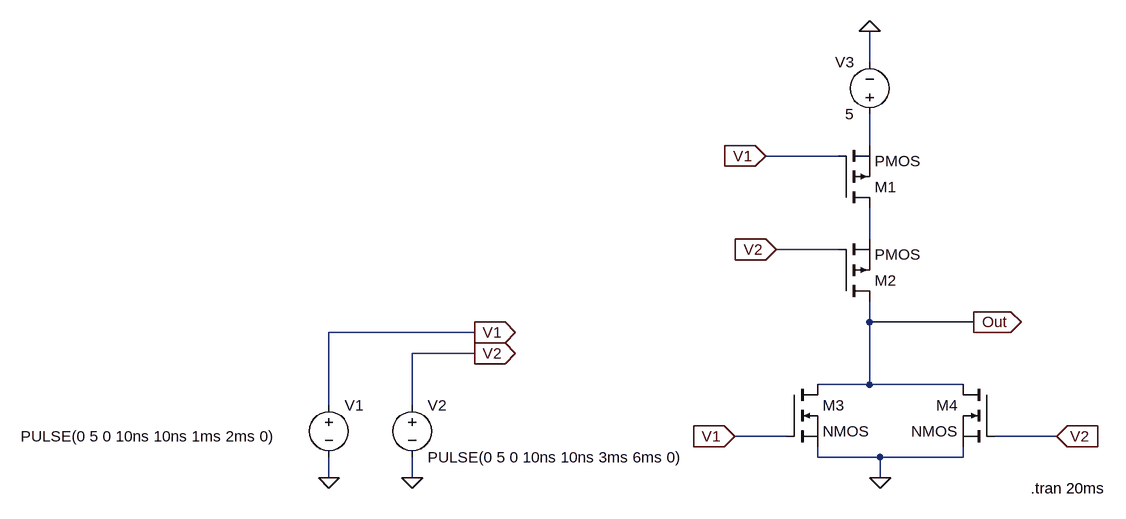
[diagram p0: schematic TP6_PORT_NOR.asc]
TP6_PORT_NOR.asc, the LTspice schematic file:
Version 4
SHEET 1 1088 804
WIRE 496 -144 496 -192
WIRE 496 -16 496 -64
WIRE 448 0 336 0
WIRE 496 128 496 80
WIRE 448 144 352 144
WIRE 496 256 496 224
WIRE 656 256 496 256
WIRE -112 272 -336 272
WIRE -112 304 -208 304
WIRE 496 352 496 256
WIRE 496 352 416 352
WIRE 640 352 496 352
WIRE -336 384 -336 272
WIRE -208 384 -208 304
WIRE 368 432 288 432
WIRE 784 432 688 432
WIRE 416 464 416 448
WIRE 512 464 416 464
WIRE 640 464 640 448
WIRE 640 464 512 464
WIRE -336 496 -336 464
WIRE -208 496 -208 464
WIRE 512 496 512 464
FLAG -336 496 0
FLAG -208 496 0
FLAG 496 -192 0
FLAG 512 496 0
FLAG 656 256 Out
IOPIN 656 256 Out
FLAG -112 272 V1
IOPIN -112 272 Out
FLAG -112 304 V2
IOPIN -112 304 Out
FLAG 336 0 V1
IOPIN 336 0 In
FLAG 352 144 V2
IOPIN 352 144 In
FLAG 784 432 V2
IOPIN 784 432 In
FLAG 288 432 V1
IOPIN 288 432 In
SYMBOL voltage -336 368 R0
WINDOW 3 -474 64 Left 2
WINDOW 123 0 0 Left 0
WINDOW 39 0 0 Left 0
SYMATTR Value PULSE(0 5 0 10ns 10ns 1ms 2ms 0)
SYMATTR InstName V1
SYMBOL voltage -208 368 R0
WINDOW 123 0 0 Left 0
WINDOW 39 0 0 Left 0
SYMATTR InstName V2
SYMATTR Value PULSE(0 5 0 10ns 10ns 3ms 6ms 0)
SYMBOL voltage 496 -48 R180
WINDOW 0 24 96 Left 2
WINDOW 3 24 16 Left 2
WINDOW 123 0 0 Left 0
WINDOW 39 0 0 Left 0
SYMATTR InstName V3
SYMATTR Value 5
SYMBOL pmos 448 80 M180
SYMATTR InstName M1
SYMBOL pmos 448 224 M180
SYMATTR InstName M2
SYMBOL nmos 368 352 R0
SYMATTR InstName M3
SYMBOL nmos 688 352 M0
SYMATTR InstName M4
TEXT 744 512 Left 2 !.tran 20ms

The netlist it stands for:
* TP6_PORT_NOR.asc
V1 V1 0 PULSE(0 5 0 10ns 10ns 1ms 2ms 0)
V2 V2 0 PULSE(0 5 0 10ns 10ns 3ms 6ms 0)
V3 N001 0 5
M1 N002 V1 N001 N001 PMOS
M2 Out V2 N002 N002 PMOS
M3 Out V1 0 0 NMOS
M4 Out V2 0 0 NMOS
.model NMOS NMOS
.model PMOS PMOS
.lib standard.mos
.tran 20ms
.backanno
.end